# Altium schematic sheet IR2104S.SchDoc
size 292 x 193 mm; Author: Power Lin; DocumentNumber: 1; SheetNumber: 1; SheetTotal: 1; Website: wiki-power.com
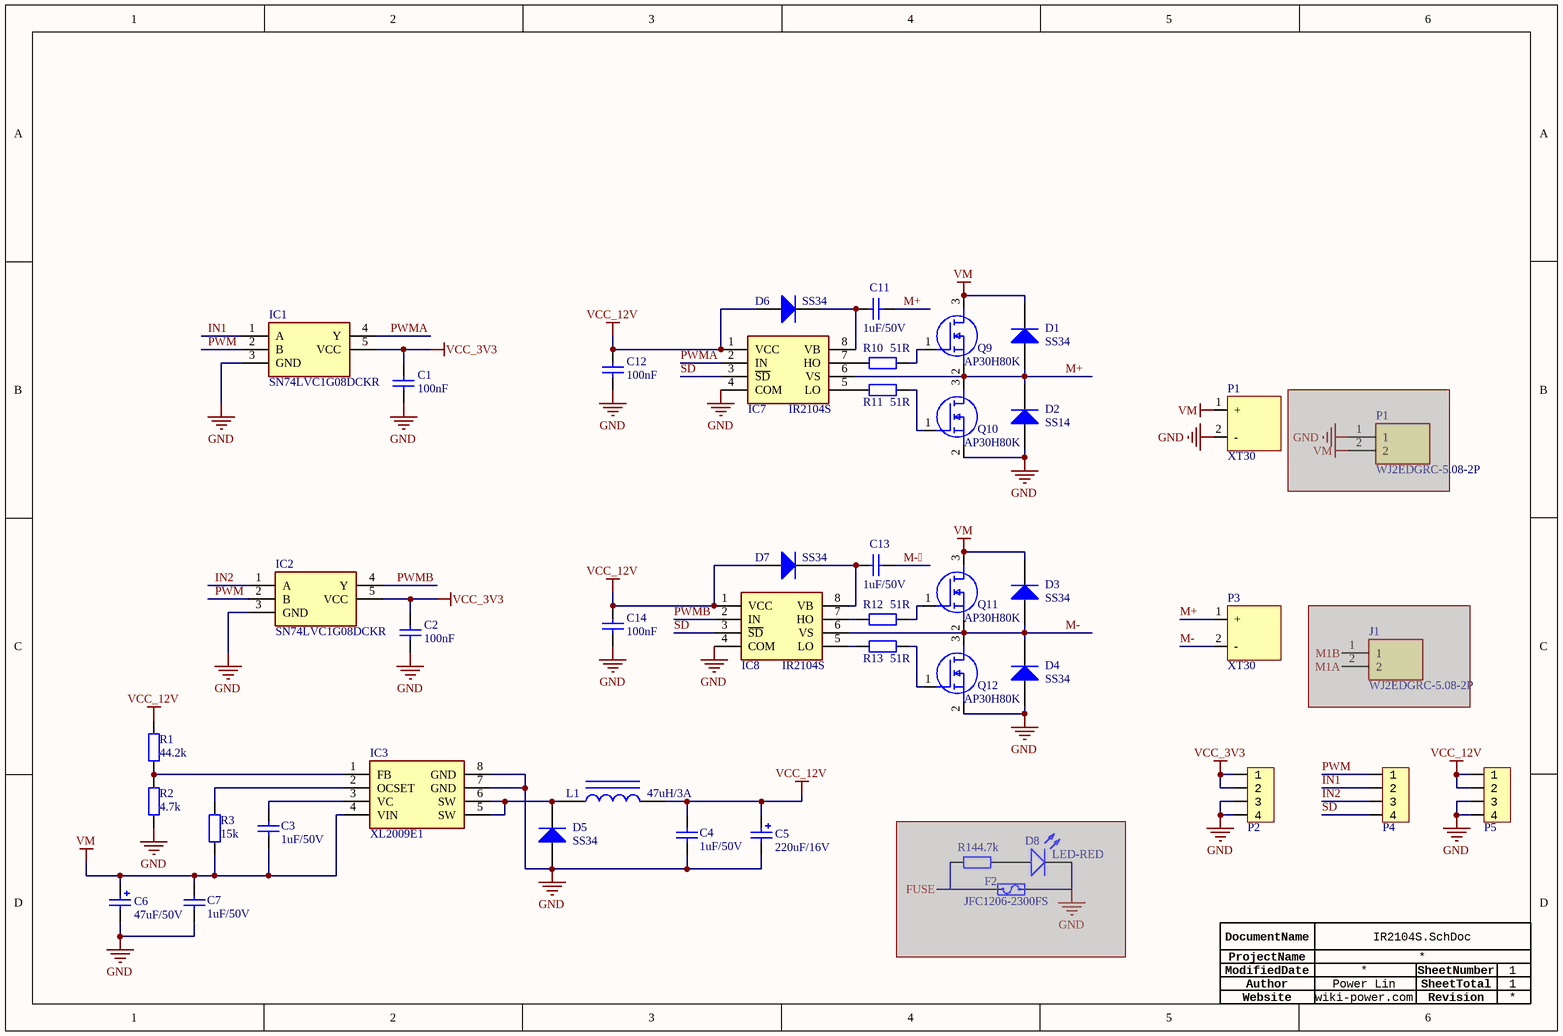
[diagram p0: IR2104S.SchDoc]

## Parts
(Parts that share a designator on the sheet are numbered #1, #2 ... from top to bottom, then left to right.)
C1  100nF  [CAP-0603]
C2  100nF  [CAP-0603]
C3  1uF/50V  [CAP-0603]
C4  1uF/50V  [CAP-0603]
C5  220uF/16V  [CM D(6.3*5.4)]
C6  47uF/50V  [CM D(6.3*5.4)]
C7  1uF/50V  [CAP-0603]
C11  1uF/50V  [CAP-0603]
C12  100nF  [CAP-0603]
C13  1uF/50V  [CAP-0603]
C14  100nF  [CAP-0603]
D1  SS34  [DO-214AC/SMA]
D2  SS14  [DO-214AC/SMA]
D3  SS34  [DO-214AC/SMA]
D4  SS34  [DO-214AC/SMA]
D5  SS34  [DO-214AC/SMA]
D6  SS34  [DO-214AC/SMA]
D7  SS34  [DO-214AC/SMA]
D8  LED-RED  [LED-0603]  (masked out: inside a compile mask, not in the netlist)
F2  JFC1206-2300FS  [FUSE_1206]  (masked out: inside a compile mask, not in the netlist)
IC1  SN74LVC1G08DCKR  [SC-70-5]
IC2  SN74LVC1G08DCKR  [SC-70-5]
IC3  XL2009E1  [SOIC_8]
IC7  IR2104S  [SOIC_8]
IC8  IR2104S  [SOIC_8]
J1  WJ2EDGRC-5.08-2P  [WJ2EDGRC-5.08-2P]  (masked out: inside a compile mask, not in the netlist)
L1  47uH/3A  [L-10040]
P1#1  XT30  [XT30UPB-M]
P1#2  WJ2EDGRC-5.08-2P  [WJ2EDGRC-5.08-2P]  (masked out: inside a compile mask, not in the netlist)
P2  HDR1x4_2.54  [HDR1x4_2.54_180]  (value not drawn)
P3  XT30  [XT30UPB-F]
P4  HDR1x4_2.54  [HDR1x4_2.54_180]  (value not drawn)
P5  HDR1x4_2.54  [HDR1x4_2.54_180]  (value not drawn)
Q9  AP30H80K  [TO-252]
Q10  AP30H80K  [TO-252]
Q11  AP30H80K  [TO-252]
Q12  AP30H80K  [TO-252]
R1  44.2k  [R-0603]
R2  4.7k  [R-0603]
R3  15k  [R-0603]
R10  51R  [R-0603]
R11  51R  [R-0603]
R12  51R  [R-0603]
R13  51R  [R-0603]
R14  4.7k  [R-0603]  (masked out: inside a compile mask, not in the netlist)

## Nets
GND: C1.1 C2.1 C4.1 C5.2 C6.2 C7.1 C12.1 C14.1 D2.1(A) D4.1(A) D5.1(A) IC1.3(GND) IC2.3(GND) IC3.7(GND) IC3.8(GND) IC7.4(COM) IC8.4(COM) P1#1.2(-) P2.3 P2.4 P5.3 P5.4 Q10.2(S) Q12.2(S) R2.1
VCC_3V3: C1.2 C2.2 IC1.5(VCC) IC2.5(VCC) P2.1 P2.2
VCC_12V: C4.2 C5.1 C12.2 C14.2 D6.1(A) D7.1(A) IC7.1(VCC) IC8.1(VCC) L1.2 P5.1 P5.2 R1.2
VM: C3.1 C6.1 C7.2 D1.2(K) D3.2(K) IC3.4(VIN) P1#1.1(+) Q9.3(D) Q11.3(D) R3.1
IN1: IC1.1(A) P4.2
IN2: IC2.1(A) P4.3
M+: C11.2 D1.1(A) D2.2(K) IC7.6(VS) P3.1(+) Q9.2(S) Q10.3(D)
M-: D3.1(A) D4.2(K) IC8.6(VS) P3.2(-) Q11.2(S) Q12.3(D)
M-: C13.2
PWM: IC1.2(B) IC2.2(B) P4.1
PWMA: IC1.4(Y) IC7.2(IN)
PWMB: IC2.4(Y) IC8.2(IN)
SD: IC7.3(~{SD}) IC8.3(~{SD}) P4.4
NetC3_2: C3.2 IC3.3(VC)
NetC11_1: C11.1 D6.2(K) IC7.8(VB)
NetC13_1: C13.1 D7.2(K) IC8.8(VB)
NetD5_2: D5.2(K) IC3.5(SW) IC3.6(SW) L1.1
NetIC3_1: IC3.1(FB) R1.1 R2.2
NetIC3_2: IC3.2(OCSET) R3.2
NetIC7_5: IC7.5(LO) R11.1
NetIC7_7: IC7.7(HO) R10.1
NetIC8_5: IC8.5(LO) R13.1
NetIC8_7: IC8.7(HO) R12.1
NetQ9_1: Q9.1(G) R10.2
NetQ10_1: Q10.1(G) R11.2
NetQ11_1: Q11.1(G) R12.2
NetQ12_1: Q12.1(G) R13.2

## Notes on the sheet
- Author
- DocumentName
- ModifiedDate
- ProjectName
- SheetNumber
- SheetTotal
- Website
- Revision

## Library data of the parts
C1-C4 C7 C11-C14 = CAP: 贴片电容; ComponentLink1Description: 供应商链接; ComponentLink1URL: http://www.szlcsc.com/product/details_53938.html; Package: 0402; Supplier: LC; SuppliersPartNumber: C52923
C5 = CAP-POL: RVT1C221M0607; ComponentLink1Description: 供应商链接; ComponentLink1URL: http://www.szlcsc.com/product/details_16815.html; Package: 3528; Supplier: LC; SuppliersPartNumber: C16133
C6 = CAP-POL: VEJ470M1HTR-0607; ComponentLink1Description: 供应商链接; ComponentLink1URL: http://www.szlcsc.com/product/details_16815.html; Package: 3528; Supplier: LC; SuppliersPartNumber: C16133
D1-D7 = DIODE: 二极管; ComponentLink1Description: 供应商链接; ComponentLink1URL: http://www.szlcsc.com/product/details_23178.html; Package: SMA(DO-214AC); Supplier: LC; SuppliersPartNumber: C22452
D8 = LED: 发光二极管; pin to pad: A>1 K>2; ComponentLink1Description: 供应商链接; ComponentLink1URL: http://www.szlcsc.com/product/details_2663.html; Package: 0603; Supplier: LC; SuppliersPartNumber: C2290
F2 = Fuse: 一次性贴片保险丝
IC1 IC2 = SN74LVC1G08DCKR: 与门; Manufacturer_Name: Texas Instruments; Datasheet Link: http://www.ti.com/lit/gpn/sn74lvc1g08; Height: 1.1mm; Manufacturer_Part_Number: SN74LVC1G08DCKR; Mouser Part Number: 595-SN74LVC1G08DCKR; Mouser Price/Stock: https://www.mouser.co.uk/ProductDetail/Texas-Instruments/SN74LVC1G08DCKR?qs=sbcp%2F4gpy0%2F8FFQ%252BRQ5MTw%3D%3D; Arrow Part Number: SN74LVC1G08DCKR; Arrow Price/Stock: https://www.arrow.com/en/products/sn74lvc1g08dckr/texas-instruments?region=nac
IC3 = XL2009E1: DC-DC电源芯片; Manufacturer_Name: Microchip; Manufacturer_Part_Number: ATTINY85-20PU; Datasheet Link: https://componentsearchengine.com/Datasheets/2/ATTINY85-20PU.pdf; Height: 5.334mm; Mouser Part Number: 556-ATTINY85-20PU; Mouser Price/Stock: https://www.mouser.com/Search/Refine.aspx?Keyword=556-ATTINY85-20PU; RS Part Number: 1331672P; RS Price/Stock: http://uk.rs-online.com/web/p/products/1331672P
IC7 IC8 = IR2104S: Integrated Circuit; Manufacturer_Name: Infineon; Datasheet Link: http://www.infineon.com/dgdl/ir2104.pdf?fileId=5546d462533600a4015355c7c1c31671; Height: 1.75mm; Manufacturer_Part_Number: IR2104S
J1 P1#2 = WJ2EDGRC-5.08-2P: Connector; Manufacturer_Name: Ningbo Kangnex; Datasheet Link: https://datasheet.lcsc.com/szlcsc/Ningbo-Kangnex-Elec-WJ2EDGRC-5-08-2P_C3697.pdf; Height: 8.3mm; Manufacturer_Part_Number: WJ2EDGRC-5.08-2P
L1 = INDUCTOR: SMMS1040; ComponentLink1Description: 供应商链接; ComponentLink1URL: http://www.szlcsc.com/product/details_33003.html; Package: 0402; Supplier: LC; SuppliersPartNumber: C32041
P1#1 P3 = XT30/60
P2 P4 P5 = HDR1x4_2.54: Header
Q9-Q12 = N-MOS: N 沟道 MOS; Manufacturer_Name: Nexperia; Manufacturer_Part_Number: SI2302DS; Datasheet Link: https://assets.nexperia.com/documents/data-sheet/SI2302DS.pdf; Height: 1.1mm; Mouser Part Number: N/A; Mouser Price/Stock: https://www.mouser.com/Search/Refine.aspx?Keyword=N%2FA; RS Part Number: 7983053P; RS Price/Stock: http://uk.rs-online.com/web/p/products/7983053P
R1-R3 R10-R14 = RES: 贴片电阻; Package: 0805; Supplier: LC; SuppliersPartNumber: C17798